# EAGLE design S88WirelessReceiver (EAGLE 7.0.0)
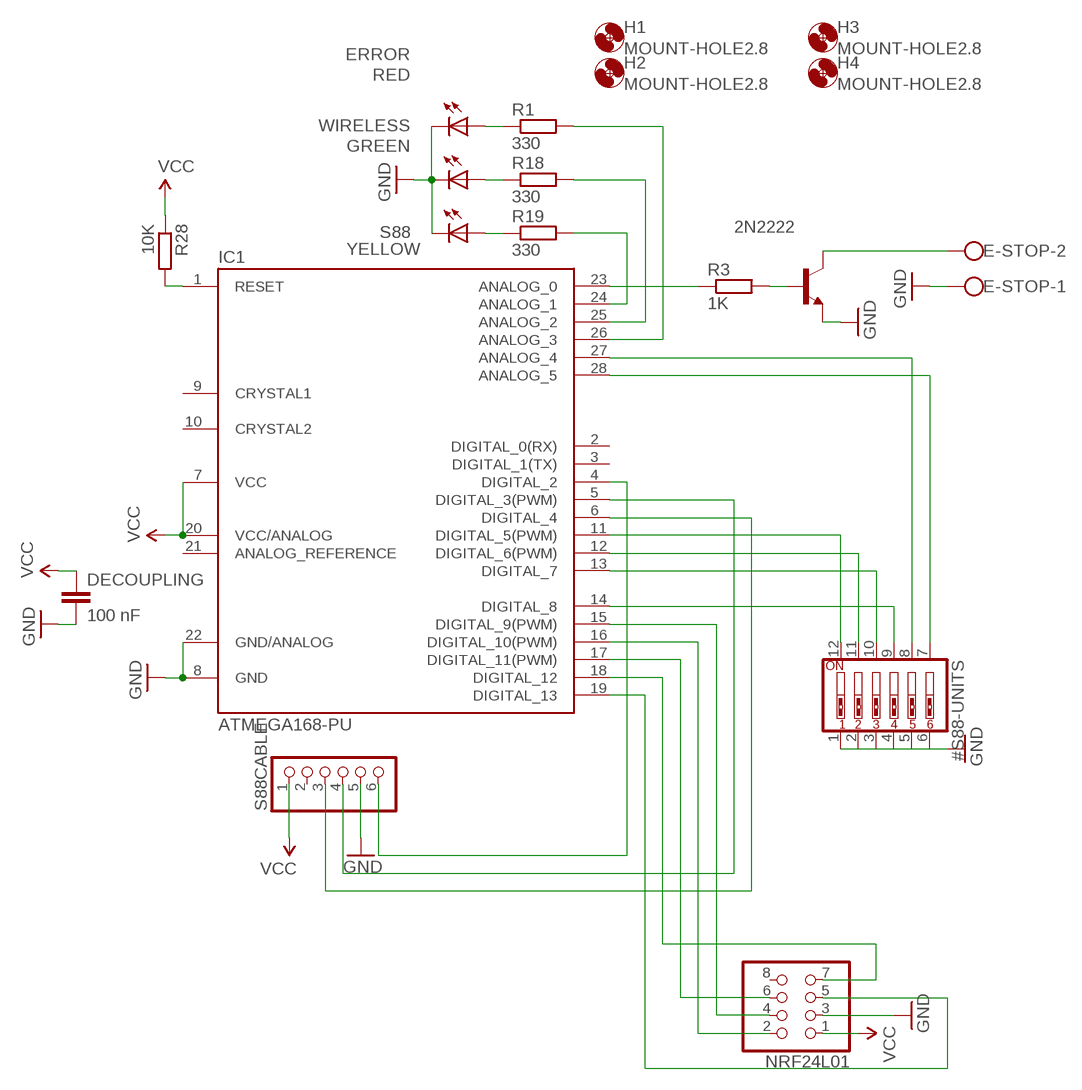
[diagram p0: schematic, sheet 1]

## Parts
2N2222  -NPN-TO92-EBC  [TO92-EBC]
#S88-UNITS  SW_DIP-6  [EDG-06]
DECOUPLING  100 nF  C-EU025-024X044  [C025-024X044]
E-STOP  W237-102  [W237-102]
ERROR  RED  LED3MM  [LED3MM]
H1  MOUNT-HOLE2.8  [2,8]
H2  MOUNT-HOLE2.8  [2,8]
H3  MOUNT-HOLE2.8  [2,8]
H4  MOUNT-HOLE2.8  [2,8]
IC1  ATMEGA168-PU  [DIL28-3]
NRF24L01  PINHD-2X4  [2X04]
R1  330  R-EU_0204/7  [0204/7]
R3  1K  R-EU_0204/2V  [0204V]
R18  330  R-EU_0204/7  [0204/7]
R19  330  R-EU_0204/7  [0204/7]
R28  10K  R-EU_0204/7  [0204/7]
S88  YELLOW  LED3MM  [LED3MM]
S88CABLE  PINHD-1X6  [1X06]
WIRELESS  GREEN  LED3MM  [LED3MM]

## Nets
GND: 2N2222.E #S88-UNITS.1 #S88-UNITS.2 #S88-UNITS.3 #S88-UNITS.4 #S88-UNITS.5 #S88-UNITS.6 DECOUPLING.2 E-STOP.1 ERROR.K(C) IC1.8(GND) IC1.22(GND/ANALOG) NRF24L01.3 S88.K(C) S88CABLE.5 WIRELESS.K(C)
N$1: IC1.4(DIGITAL_2) S88CABLE.6
N$2: IC1.16(DIGITAL_10(PWM)) NRF24L01.2
N$3: IC1.15(DIGITAL_9(PWM)) NRF24L01.4
N$4: IC1.19(DIGITAL_13) NRF24L01.5
N$5: IC1.17(DIGITAL_11(PWM)) NRF24L01.6
N$6: IC1.18(DIGITAL_12) NRF24L01.7
N$7: IC1.5(DIGITAL_3(PWM)) S88CABLE.4
N$8: IC1.6(DIGITAL_4) S88CABLE.3
N$9: #S88-UNITS.12 IC1.11(DIGITAL_5(PWM))
N$10: #S88-UNITS.11 IC1.12(DIGITAL_6(PWM))
N$11: #S88-UNITS.10 IC1.13(DIGITAL_7)
N$12: #S88-UNITS.9 IC1.14(DIGITAL_8)
N$13: #S88-UNITS.7 IC1.28(ANALOG_5)
N$14: #S88-UNITS.8 IC1.27(ANALOG_4)
N$15: 2N2222.B R3.2
N$16: ERROR.A R1.1
N$17: IC1.26(ANALOG_3) R1.2
N$18: IC1.23(ANALOG_0) R3.1
N$19: 2N2222.C E-STOP.2
N$20: IC1.25(ANALOG_2) R18.2
N$28: R18.1 WIRELESS.A
N$30: R19.1 S88.A
N$36: IC1.1(RESET) R28.2
N$38: IC1.24(ANALOG_1) R19.2
VCC: DECOUPLING.1 IC1.7(VCC) IC1.20(VCC/ANALOG) NRF24L01.1 R28.1 S88CABLE.1
Unconnected: IC1.2(DIGITAL_0(RX)) IC1.3(DIGITAL_1(TX)) IC1.9(CRYSTAL1) IC1.10(CRYSTAL2) IC1.21(ANALOG_REFERENCE) NRF24L01.8 S88CABLE.2

## Library data of the parts
2N2222 = transistor-neu-to92:*-NPN-: NPN Transistror
#S88-UNITS = special:SW_DIP-6: DIP SWITCH
DECOUPLING = rcl:C-EU: CAPACITOR, European symbol
E-STOP = con-wago-500:W237-102: WAGO SCREW CLAMP; MPN: 237-102; OC_FARNELL: unknown; OC_NEWARK: 70K9898
ERROR S88 WIRELESS = SparkFun-LED:LED: LEDs
H1-H4 = holes:MOUNT-HOLE: MOUNTING HOLE with drill center marker
IC1 = Arduino-AVR:ATMEGA168-PU
NRF24L01 = pinhead:PINHD-2X4: PIN HEADER
R1 R18 R19 R28 = rcl:R-EU_: RESISTOR, European symbol
R3 = resistor:R-EU_: RESISTOR, European symbol
S88CABLE = pinhead:PINHD-1X6: PIN HEADER

## Board
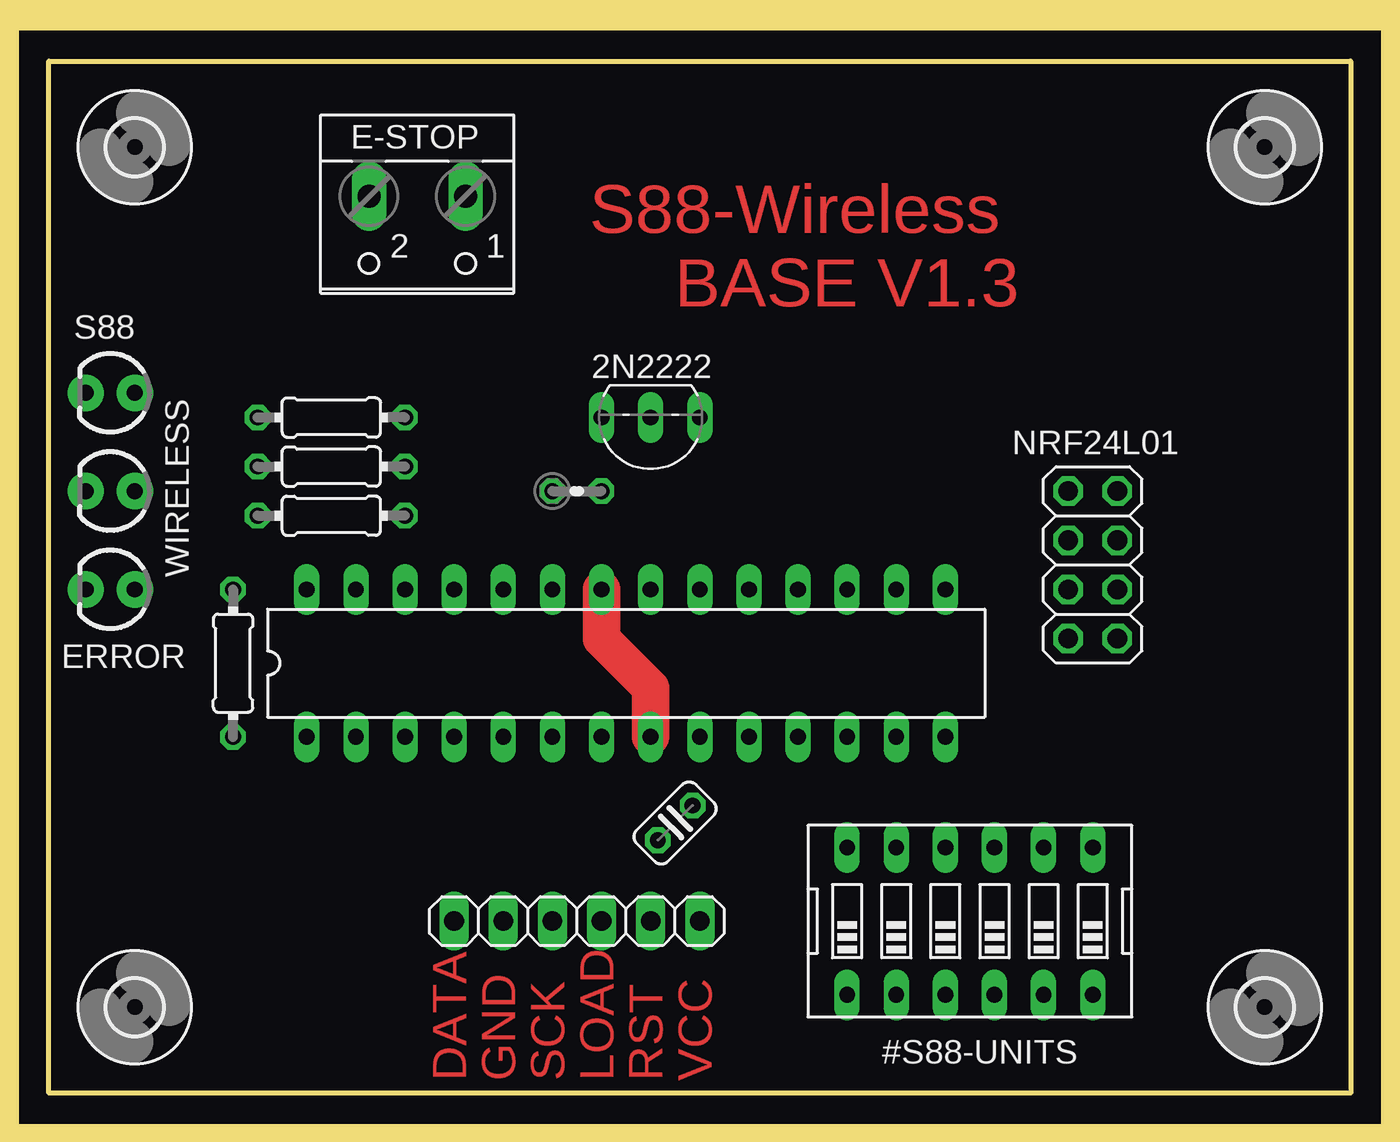
[diagram p1: board, top side]
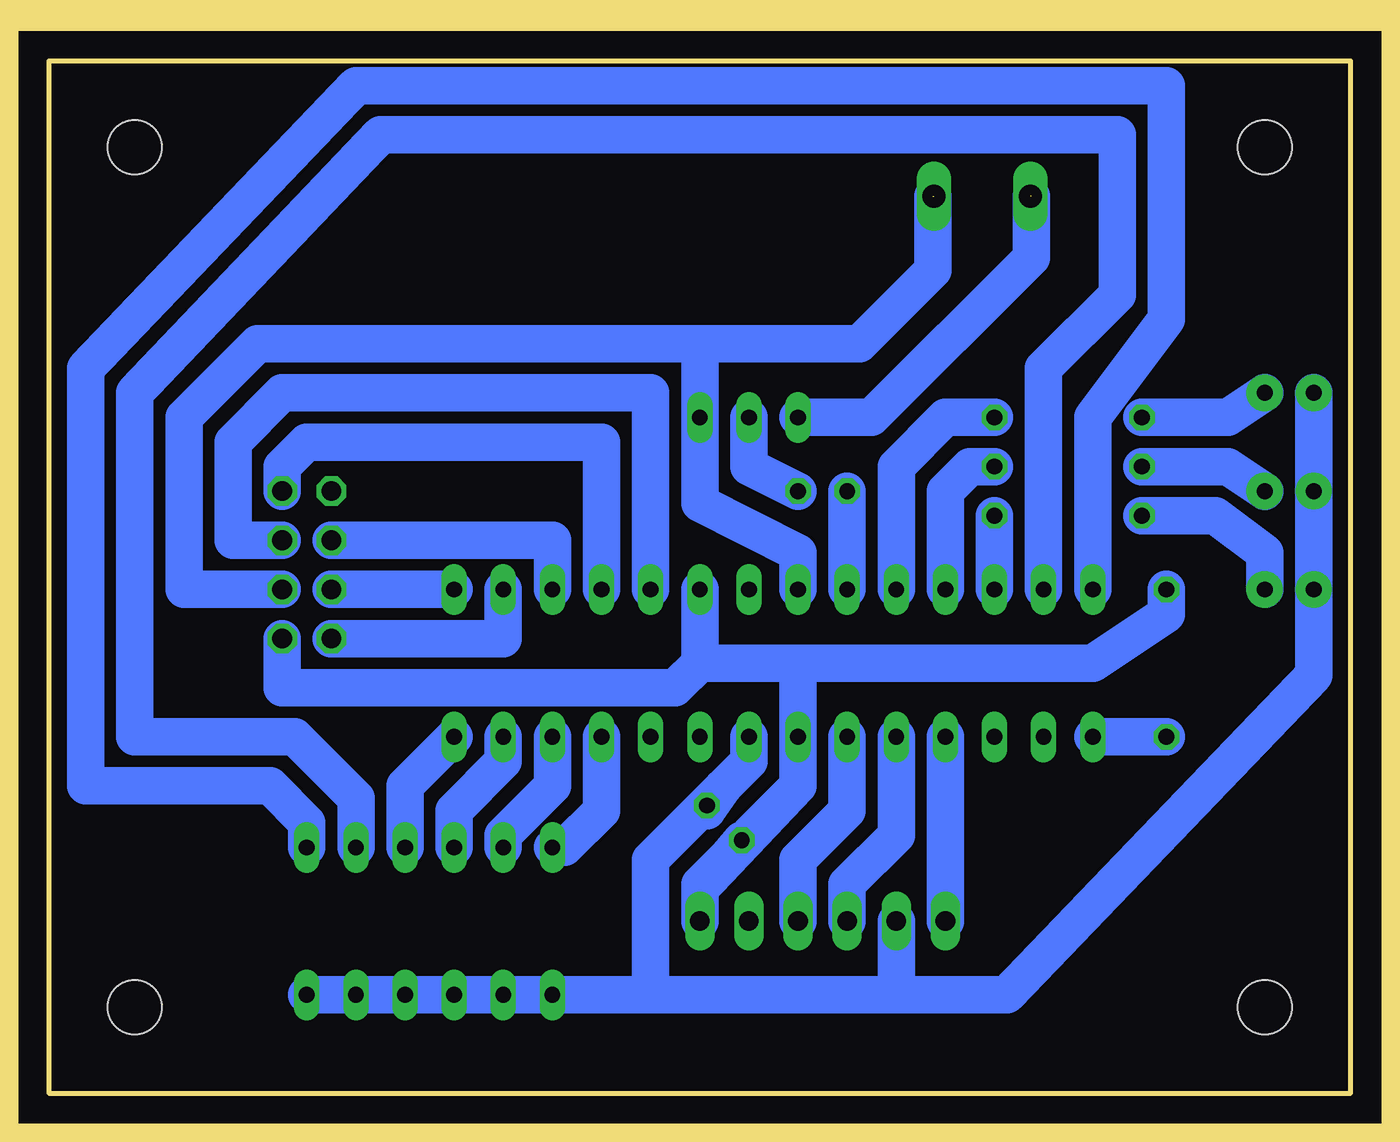
[diagram p2: board, bottom side, seen from below]

Size 67.31 x 53.34 mm. Coordinates in mm from the lower left corner, seen from the top.
Outline: 0,0 0,53.34 67.31,53.34 67.31,0 0,0
Copper layers (1*16): Top 0.035mm / dielectric 1.5mm / Bottom 0.035mm
Design rules "default": minimum track width 10mil, minimum drill 24mil, track to track 8mil, track to pad 8mil, pad to pad 8mil, via to via 8mil, smd to smd 8mil, copper to edge 40mil, drill to drill 8mil, minimum pad ring 10mil, minimum via ring 8mil, stop-mask expansion 4mil, vias tented up to drill 0mil, thermal gap 10mil
Milling: 4 lines

### Footprints (pad centres in the part's own frame; a part is rotated, then mirrored left to right if it is on the bottom)
TO92-EBC = drill 0.813 long: B 0,-1.27; C 2.54,-1.27; E -2.54,-1.27
EDG-06 = drill 0.813 long: 1 -6.35,-3.81; 2 -3.81,-3.81; 3 -1.27,-3.81; 4 1.27,-3.81; 5 3.81,-3.81; 6 6.35,-3.81; 7 6.35,3.81; 8 3.81,3.81; 9 1.27,3.81; 10 -1.27,3.81; 11 -3.81,3.81; 12 -6.35,3.81
C025-024X044 = drill 0.813 octagon: 1 -1.27,0; 2 1.27,0
W237-102 = drill 1.194 long: 1 -2.5,-1.27; 2 2.5,-1.27
LED3MM = drill 0.813 pad 1.88: A -1.27,0; K 1.27,0
2,8 = hole 2.8: 0,0
DIL28-3 = drill 0.813 long: 1 -16.51,-3.81; 2 -13.97,-3.81; 3 -11.43,-3.81; 4 -8.89,-3.81; 5 -6.35,-3.81; 6 -3.81,-3.81; 7 -1.27,-3.81; 8 1.27,-3.81; 9 3.81,-3.81; 10 6.35,-3.81; 11 8.89,-3.81; 12 11.43,-3.81; 13 13.97,-3.81; 14 16.51,-3.81; 15 16.51,3.81; 16 13.97,3.81; 17 11.43,3.81; 18 8.89,3.81; 19 6.35,3.81; 20 3.81,3.81; 21 1.27,3.81; 22 -1.27,3.81; 23 -3.81,3.81; 24 -6.35,3.81; 25 -8.89,3.81; 26 -11.43,3.81; 27 -13.97,3.81; 28 -16.51,3.81
2X04 = drill 1.016 octagon: 1 -3.81,-1.27; 2 -3.81,1.27; 3 -1.27,-1.27; 4 -1.27,1.27; 5 1.27,-1.27; 6 1.27,1.27; 7 3.81,-1.27; 8 3.81,1.27
0204/7 = drill 0.813 octagon: 1 -3.81,0; 2 3.81,0
0204V = drill 0.813 octagon: 1 -1.27,0; 2 1.27,0
1X06 = drill 1.016 long: 1 -6.35,0; 2 -3.81,0; 3 -1.27,0; 4 1.27,0; 5 3.81,0; 6 6.35,0

### Placement (x,y rotation side)
2N2222  31.12,33.66 180 top
#S88-UNITS  47.62,8.89 0 top
DECOUPLING  32.38,13.97 45 top
E-STOP  19.05,45.09 180 top
ERROR  3.17,26.04 180 top
H1  62.87,4.45 0 top
H2  62.87,48.9 0 top
H3  4.45,4.45 0 top
H4  4.45,48.9 0 top
IC1  29.84,22.23 0 top
NRF24L01  53.98,27.3 90 top
R1  14.61,29.84 0 top
R3  27.3,31.12 0 top
R18  14.61,32.38 0 top
R19  14.61,34.93 0 top
R28  9.52,22.23 270 top
S88  3.17,36.2 180 top
S88CABLE  27.3,8.89 180 top
WIRELESS  3.17,31.12 180 top

### Tracks (layer width: path | path; a pad name or v marks a point on that pad's centre or on a via)
GND  (1 unrouted)
  Top 1.93: IC1.22 28.57,23.5 31.12,20.96 IC1.8
  Bottom 1.93: 23.5,5.08 17.78,5.08 1.91,21.59 S88.K WIRELESS.K ERROR.K | 33.66,38.73 56.52,38.73 60.33,34.93 60.33,26.04 NRF24L01.3 | 33.66,38.73 2N2222.E 33.66,30.48 28.57,27.94 IC1.22 | 23.5,5.08 S88CABLE.5 | 23.5,5.08 36.2,5.08 | 36.2,5.08 36.2,12.07 32.38,15.88 | 32.38,15.88 31.12,17.14 IC1.8 | 36.2,5.08 #S88-UNITS.1 #S88-UNITS.2 #S88-UNITS.3 #S88-UNITS.4 #S88-UNITS.5 #S88-UNITS.6 | 21.59,46.36 21.59,42.55 25.4,38.73 33.66,38.73 | 33.28,14.61 32.38,15.88 | 32.38,15.88 DECOUPLING.2
N$1
  Bottom 1.93: IC1.4 S88CABLE.6
N$2
  Bottom 1.93: IC1.16 43.81,23.5 NRF24L01.2
N$3
  Bottom 1.93: IC1.15 NRF24L01.4
N$4
  Bottom 1.93: IC1.19 36.2,36.2 55.24,36.2 57.79,33.66 57.79,28.57 NRF24L01.5
N$5
  Bottom 1.93: IC1.17 41.27,28.57 NRF24L01.6
N$6
  Bottom 1.93: IC1.18 38.73,33.66 53.98,33.66 55.24,32.38 NRF24L01.7
N$7
  Bottom 1.93: IC1.5 23.5,13.34 26.04,10.8 S88CABLE.4
N$8
  Bottom 1.93: S88CABLE.3 28.57,12.07 26.04,14.61 IC1.6
N$9
  Bottom 1.93: IC1.11 38.73,14.61 40.64,12.7 #S88-UNITS.12
N$10
  Bottom 1.93: #S88-UNITS.11 43.81,13.34 41.27,15.88 IC1.12
N$11
  Bottom 1.93: IC1.13 43.81,17.14 46.36,14.61 #S88-UNITS.10
N$12
  Bottom 1.93: IC1.14 48.9,15.88 #S88-UNITS.9
N$13
  Bottom 1.93: IC1.28 13.34,34.93 9.52,40.01 9.52,52.07 51.44,52.07 65.4,37.47 65.4,15.88 55.88,15.88 53.98,13.97 #S88-UNITS.7
N$14
  Bottom 1.93: #S88-UNITS.8 51.44,15.24 54.61,18.41 62.87,18.41 62.87,36.2 50.16,49.53 12.07,49.53 12.07,41.27 15.88,37.47 IC1.27
N$15
  Bottom 1.93: R3.2 31.12,32.38 2N2222.B
N$16
  Bottom 1.93: ERROR.A 4.45,27.94 6.99,29.84 R1.1
N$17
  Bottom 1.93: R1.2 IC1.26
N$18
  Bottom 1.93: IC1.23 R3.1
N$19  (1 unrouted)
  Bottom 1.93: 16.51,46.36 16.51,43.18 24.77,34.93 2N2222.C
N$20
  Bottom 1.93: R18.2 19.69,32.38 20.96,31.12 IC1.25
N$28
  Bottom 1.93: R18.1 6.35,32.38 WIRELESS.A
N$30
  Bottom 1.93: R19.1 6.35,34.93 S88.A
N$36
  Bottom 1.93: R28.2 IC1.1
N$38
  Bottom 1.93: R19.2 20.96,34.93 23.5,32.38 IC1.24
VCC
  Bottom 1.93: 28.57,22.23 33.66,22.23 | 33.66,22.23 IC1.20 | R28.1 9.52,24.77 13.34,22.23 28.57,22.23 | 33.66,22.23 34.93,20.96 55.24,20.96 NRF24L01.1 | 28.57,22.23 IC1.7 28.57,15.88 | 33.66,10.53 33.66,10.8 28.57,15.88 | 33.66,10.53 S88CABLE.1 | DECOUPLING.1 33.66,10.53 | 33.66,10.53 28.57,15.88

### Text on the board
Top: S88-Wireless / BASE V1.3 | DATA | GND | SCK | LOAD | RST | VCC